# EAGLE schematic RFM69Pi_G1 (EAGLE 7.0.0)
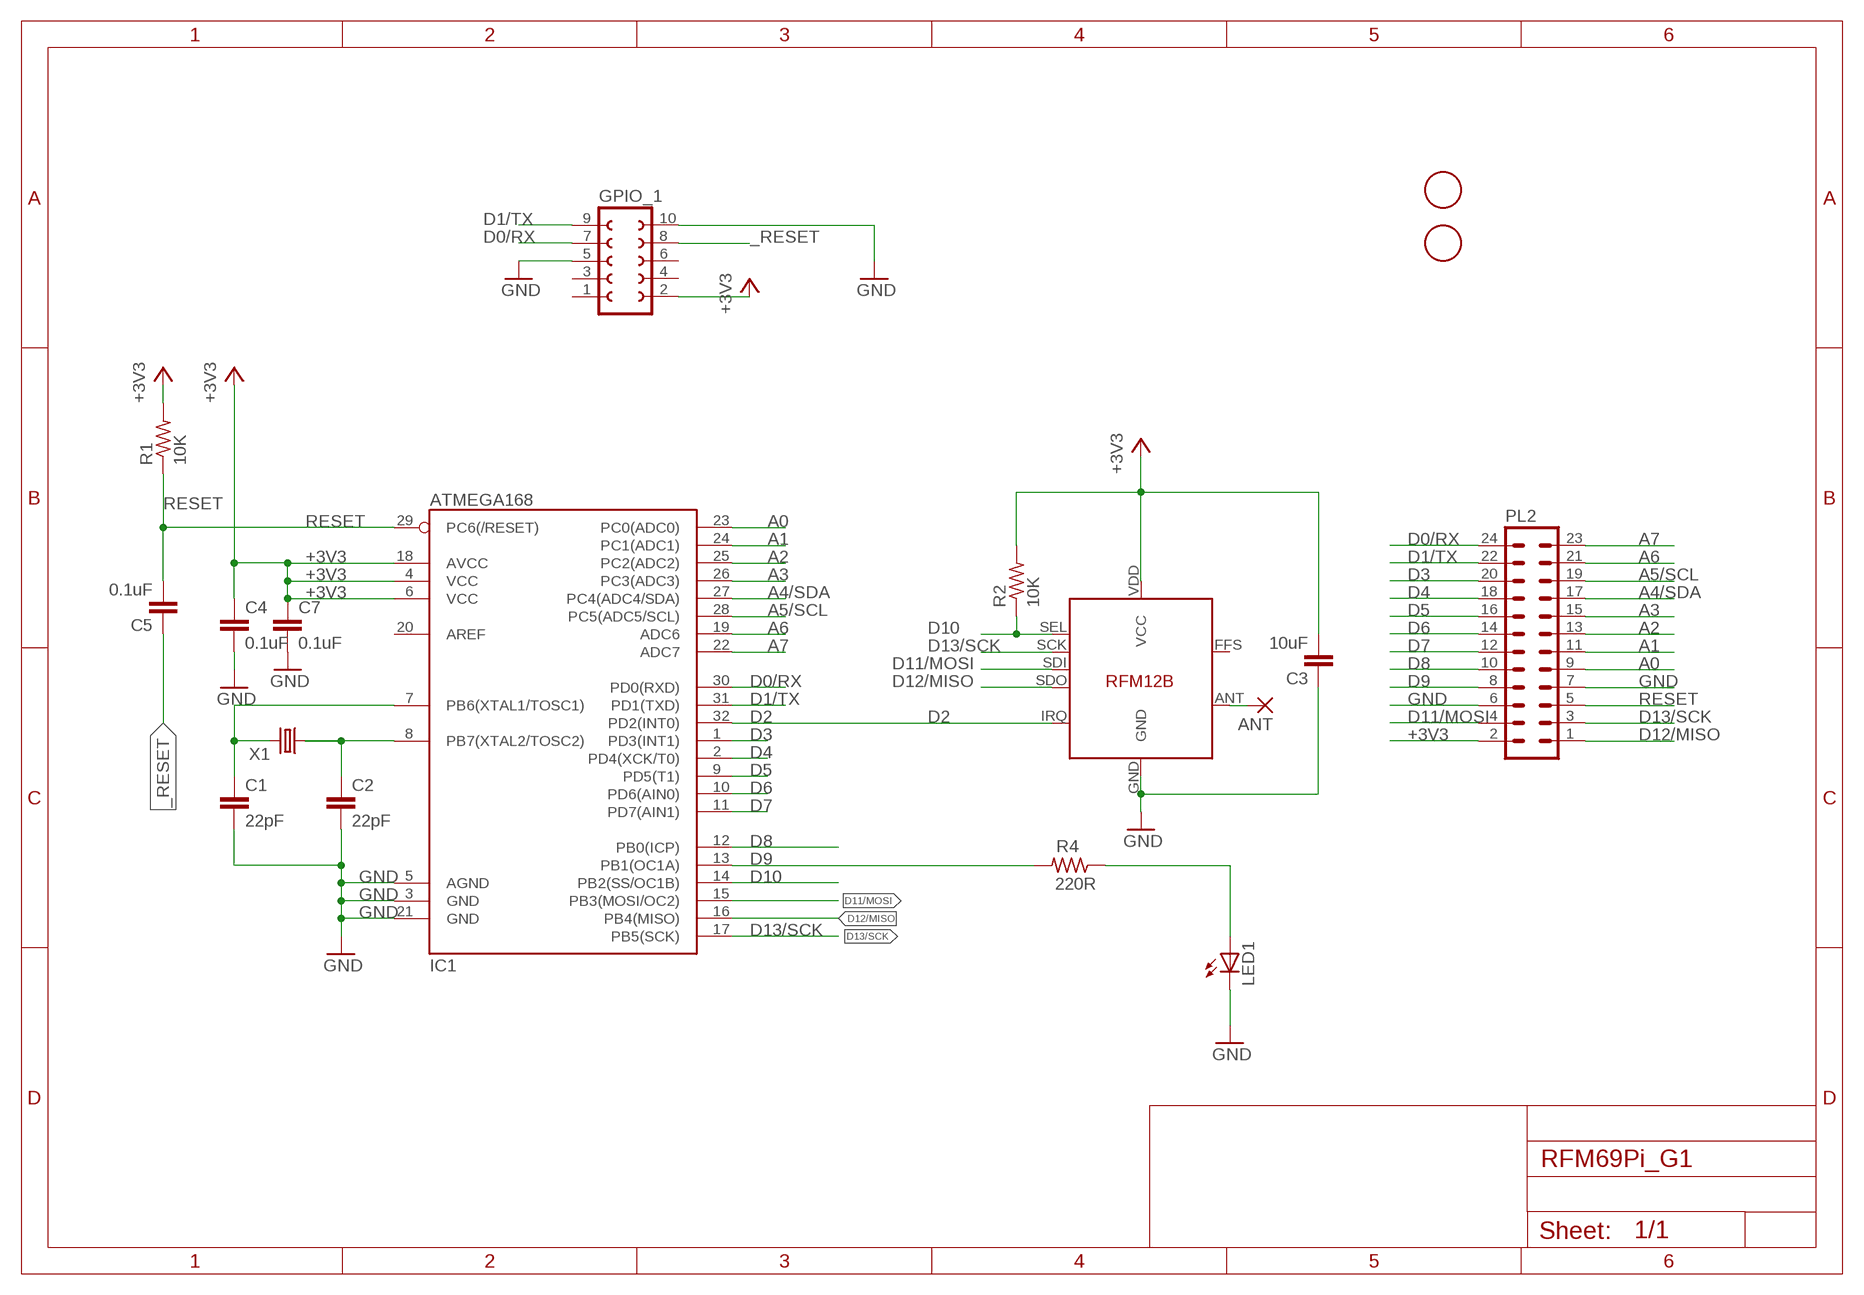
[diagram p0: schematic, sheet 1]

## Parts
ANT  1,6/0,8  [1,6/0,8]
C1  22pF  C-EUC0603  [C0603]
C2  22pF  C-EUC0603  [C0603]
C3  10uF  C-EUC0603  [C0603]
C4  0.1uF  C-EUC0603  [C0603]
C5  0.1uF  C-EUC0603  [C0603]
C7  0.1uF  C-EUC0603  [C0603]
GPIO_1  FE05-2  [FE05-2]
IC1  ATMEGA168  [TQFP32-08]
LED1  LEDSML0603  [SML0603]
PL2  MA12-2  [MA12-2]
R1  10K  R-US_R0603  [R0603]
R2  10K  R-US_R0603  [R0603]
R4  220R  R-US_R0603  [R0603]
RFM12B-RFM69CW  RFM12B  [RFM12B]
U$1  FIDUCIAL  [FIDUCIAL_1MM]
U$2  FIDUCIAL  [FIDUCIAL_1MM]
X1  CRYSTALHC49US  [HC49US]

## Nets
+3V3 [power]: C3.2 C4.1 C7.1 GPIO_1.2 IC1.4(VCC) IC1.6(VCC) IC1.18(AVCC) PL2.2 R1.2 R2.2 RFM12B-RFM69CW.VDD(VCC)
_RESET: C5.1 GPIO_1.8
A0: IC1.23(PC0(ADC0)) PL2.9
A1: IC1.24(PC1(ADC1)) PL2.11
A2: IC1.25(PC2(ADC2)) PL2.13
A3: IC1.26(PC3(ADC3)) PL2.15
A4/SDA: IC1.27(PC4(ADC4/SDA)) PL2.17
A5/SCL: IC1.28(PC5(ADC5/SCL)) PL2.19
A6: IC1.19(ADC6) PL2.21
A7: IC1.22(ADC7) PL2.23
D0/RX: GPIO_1.7 IC1.30(PD0(RXD)) PL2.24
D1/TX: GPIO_1.9 IC1.31(PD1(TXD)) PL2.22
D2: IC1.32(PD2(INT0)) RFM12B-RFM69CW.IRQ
D3: IC1.1(PD3(INT1)) PL2.20
D4: IC1.2(PD4(XCK/T0)) PL2.18
D5: IC1.9(PD5(T1)) PL2.16
D6: IC1.10(PD6(AIN0)) PL2.14
D7: IC1.11(PD7(AIN1)) PL2.12
D8: IC1.12(PB0(ICP)) PL2.10
D9: IC1.13(PB1(OC1A)) PL2.8 R4.2
D10: IC1.14(PB2(SS/OC1B)) R2.1 RFM12B-RFM69CW.SEL
D11/MOSI: IC1.15(PB3(MOSI/OC2)) PL2.4 RFM12B-RFM69CW.SDI
D12/MISO: IC1.16(PB4(MISO)) PL2.1 RFM12B-RFM69CW.SDO
D13/SCK: IC1.17(PB5(SCK)) PL2.3 RFM12B-RFM69CW.SCK
GND [power]: C1.2 C2.2 C3.1 C4.2 C7.2 GPIO_1.5 GPIO_1.10 IC1.3(GND) IC1.5(AGND) IC1.21(GND) LED1.C PL2.6 PL2.7 RFM12B-RFM69CW.GND
N$1: C1.1 IC1.7(PB6(XTAL1/TOSC1)) X1.2
N$2: C2.1 IC1.8(PB7(XTAL2/TOSC2)) X1.1
N$3: LED1.A R4.1
N$6 [power]: ANT.1(P) RFM12B-RFM69CW.ANT
RESET: C5.2 IC1.29(PC6(/RESET)) PL2.5 R1.1
Unconnected: GPIO_1.1 GPIO_1.3 GPIO_1.4 GPIO_1.6 IC1.20(AREF) RFM12B-RFM69CW.FFS

## Library data of the parts
ANT = JeeLabs:1,6/0,8: THROUGH-HOLE PAD
C1-C5 = rcl:C-EU: CAPACITOR, European symbol
C7 = resistor:C-EU: CAPACITOR, European symbol
GPIO_1 = con-lsta:FE05-2: FEMALE HEADER; OC_FARNELL: unknown; OC_NEWARK: unknown
IC1 = SparkFun:ATMEGA168
LED1 = led:LED: LED OSRAM: - CHIPLED LG R971, LG N971, LY N971, LG Q971, LY Q971, LO R971, LY R971 LH N974, LH R974 LS Q976, LO Q976, LY Q976 LO Q996 - Hyper CHIPLED LW Q18S LB Q993, LB Q99A, LB R99A - SideLED LS A670, LO A670, LY A670, LG A670, LP A670 LB A673, LV A673, LT A673, LW A673 LH A674 LY A675 LS A676, LA A676, LO A676, LY A676, LW A676 LS A679, LY A679, LG A679 - Hyper Micro SIDELED® LS Y876, LA Y876, LO Y876, LY Y876 LT Y87S - SmartLED LW L88C, LW L88S LB L89C, LB L89S, LG L890 LS L89K, LO L89K, LY L89K LS L896, LA L896, LO L896, LY L896 - TOPLED LS T670, LO T670, LY T670, LG T670, LP T670 LSG T670, LSP T670, LSY T670, LOP T670, LYG T670 LG T671, LOG T671, LSG T671 LB T673, LV T673, LT T673, LW T673 LH T674 LS T676, LA T676, LO T676, LY T676, LB T676, LH T676, LSB T676, LW T676 LB T67C, LV T67C, LT T67C, LS T67K, LO T67K, LY T67K, LW E67C LS E67B, LA E67B, LO E67B, LY E67B, LB E67C, LV E67C, LT E67C LW T67C LS T679, LY T679, LG T679 LS T770, LO T770, LY T770, LG T770, LP T770 LB T773, LV T773, LT T773, LW T773 LH T774 LS E675, LA E675, LY E675, LS T675 LS T776, LA T776, LO T776, LY T776, LB T776 LHGB T686 LT T68C, LB T68C - Hyper Mini TOPLED® LB M676 - Mini TOPLED Santana® LG M470 LS M47K, LO M47K, LY M47K Source: http://www.osram.convergy.de LUXEON: - LUMILED® LXK2-PW12-R00, LXK2-PW12-S00, LXK2-PW14-U00, LXK2-PW14-V00 LXK2-PM12-R00, LXK2-PM12-S00, LXK2-PM14-U00 LXK2-PE12-Q00, LXK2-PE12-R00, LXK2-PE12-S00, LXK2-PE14-T00, LXK2-PE14-U00 LXK2-PB12-K00, LXK2-PB12-L00, LXK2-PB12-M00, LXK2-PB14-N00, LXK2-PB14-P00, LXK2-PB14-Q00 LXK2-PR12-L00, LXK2-PR12-M00, LXK2-PR14-Q00, LXK2-PR14-R00 LXK2-PD12-Q00, LXK2-PD12-R00, LXK2-PD12-S00 LXK2-PH12-R00, LXK2-PH12-S00 LXK2-PL12-P00, LXK2-PL12-Q00, LXK2-PL12-R00 Source: www.luxeon.com KINGBRIGHT: KA-3528ASYC Source: www.kingbright.com
PL2 = con-lstb:MA12-2: PIN HEADER; OC_FARNELL: unknown; OC_NEWARK: unknown
R1 R2 R4 = adafruit:R-US_: RESISTOR, American symbol
RFM12B-RFM69CW = JeeLabs:RFM12B
U$1 U$2 = adafruit:FIDUCIAL: For use by pick and place machines to calibrate the vision/machine, 1mm By microbuilder.eu
X1 = SparkFun:CRYSTAL: Crystals Various standard crystals. Proven footprints. Spark Fun Electronics SKU : COM-00534

## Net classes
0 default: width 0.203 mm, drill 0.203 mm, clearance 0.203 mm
1 power: width 0.254 mm, drill 0.254 mm, clearance 0.254 mm